# Altium schematic sheet PCB_DYBoard_Bandmaster_V2_SCH1.SchDoc
size A4; SheetNumber: 1; SheetTotal: 4
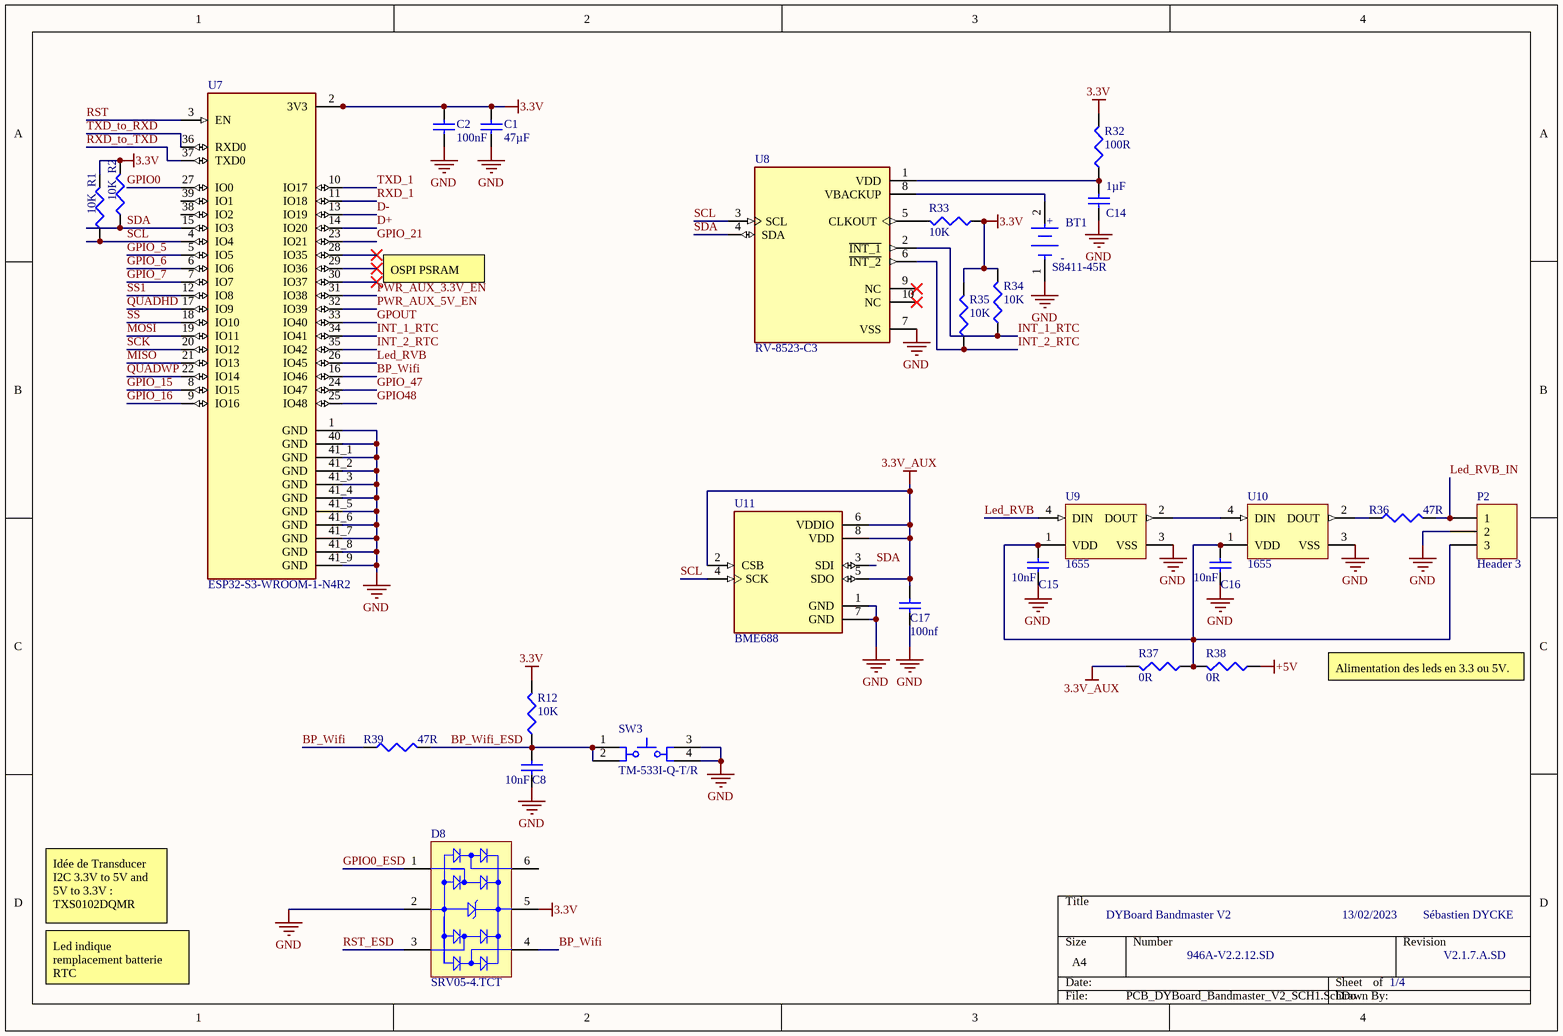
[diagram p0: PCB_DYBoard_Bandmaster_V2_SCH1.SchDoc]

## Parts
BT1  S8411-45R  [FP-S8411-45R-MFG]
C1  value 47µF  [1608[0603]]  (hidden comment: Cap Semi)
C2  value 100nF  [1608[0603]]  (hidden comment: Cap Semi)
C8  value 10nF  [1608[0603]]  (hidden comment: Cap Semi)
C14  value 1µF  [1608[0603]]  (hidden comment: Cap Semi)
C15  value 10nF  [1608[0603]]  (hidden comment: Cap Semi)
C16  value 10nF  [1608[0603]]  (hidden comment: Cap Semi)
C17  value 100nf  [1608[0603]]  (hidden comment: Cap Semi)
D8  SRV05-4.TCT  [SMTC-SOT23-6_V]
P2  Header 3  [HDR1X3]
R1  value 10K  [J1-0603]  (hidden comment: Res3)
R2  value 10K  [J1-0603]  (hidden comment: Res3)
R12  value 10K  [J1-0603]  (hidden comment: Res3)
R32  value 100R  [J1-0603]  (hidden comment: Res3)
R33  value 10K  [J1-0603]  (hidden comment: Res3)
R34  value 10K  [J1-0603]  (hidden comment: Res3)
R35  value 10K  [J1-0603]  (hidden comment: Res3)
R36  value 47R  [J1-0603]  (hidden comment: Res3)
R37  value 0R  [J1-0603]  (hidden comment: Res3)
R38  value 0R  [J1-0603]  (hidden comment: Res3)
R39  value 47R  [J1-0603]  (hidden comment: Res3)
SW3  TM-533I-Q-T/R  [MULT-TM-533I-Q_V]
U7  ESP32-S3-WROOM-1-N4R2  [XCVR_ESP32-S3-WROOM-1-N4R2]
U8  RV-8523-C3  [IC_RV-8523-C3]
U9  1655  [ADA-RGB-1655_V]
U10  1655  [ADA-RGB-1655_V]
U11  BME688  [IC_BME688]

## Nets
3.3V: C1.2 C2.2 D8.5(VBUS) R1.2 R2.2 R12.2 R32.2 R33.1 R34.2 R35.2 U7.2(3V3)
3.3V_AUX: C17.2 R37.2 U11.2(CSB) U11.5(SDO) U11.6(VDDIO) U11.8(VDD)
+5V: R38.1
GND: BT1.1(C) C1.1 C2.1 C8.1 C14.1 C15.1 C16.1 C17.1 D8.2(GND) P2.2 SW3.3 SW3.4 U7.1(GND) U7.40(GND) U7.41_1(GND) U7.41_2(GND) U7.41_3(GND) U7.41_4(GND) U7.41_5(GND) U7.41_6(GND) U7.41_7(GND) U7.41_8(GND) U7.41_9(GND) U8.7(VSS) U9.3(VSS) U10.3(VSS) U11.1(GND) U11.7(GND)
BP_Wifi: D8.4(I/O_3) R39.1 U7.16(IO46)
BP_Wifi_ESD: C8.2 R12.1 R39.2 SW3.1 SW3.2
D+: U7.14(IO20)
D-: U7.13(IO19)
GPIO0: U7.27(IO0)
GPIO0_ESD: D8.1(I/O_1)
GPIO48: U7.25(IO48)
GPIO_5: U7.5(IO5)
GPIO_6: U7.6(IO6)
GPIO_7: U7.7(IO7)
GPIO_15: U7.8(IO15)
GPIO_16: U7.9(IO16)
GPIO_21: U7.23(IO21)
GPIO_47: U7.24(IO47)
GPOUT: U7.33(IO40)
INT_1_RTC: R34.1 U7.34(IO41) U8.2(~{INT_1})
INT_2_RTC: R35.1 U7.35(IO42) U8.6(~{INT_2})
Led_RVB: U7.26(IO45) U9.4(DIN)
Led_RVB_IN: P2.1 R36.2
MISO: U7.21(IO13)
MOSI: U7.19(IO11)
PWR_AUX_3.3V_EN: U7.31(IO38)
PWR_AUX_5V_EN: U7.32(IO39)
QUADHD: U7.17(IO9)
QUADWP: U7.22(IO14)
RST: U7.3(EN)
RST_ESD: D8.3(I/O_2)
RXD_1: U7.11(IO18)
RXD_to_TXD: U7.37(TXD0)
SCK: U7.20(IO12)
SCL: R1.1 U7.4(IO4) U8.3(SCL) U11.4(SCK)
SDA: R2.1 U7.15(IO3) U8.4(SDA) U11.3(SDI)
SS: U7.18(IO10)
SS1: U7.12(IO8)
TXD_1: U7.10(IO17)
TXD_to_RXD: U7.36(RXD0)
NetBT1_2: BT1.2(A) U8.8(VBACKUP)
NetC14_2: C14.2 R32.1 U8.1(VDD)
NetC15_2: C15.2 C16.2 P2.3 R37.1 R38.2 U9.1(VDD) U10.1(VDD)
NetR33_2: R33.2 U8.5(CLKOUT)
NetR36_1: R36.1 U10.2(DOUT)
NetU9_2: U9.2(DOUT) U10.4(DIN)

Not connected (* = marked no-connect by the designer): D8 6(I/O_4); U7 28(IO35)* 29(IO36)* 30(IO37)* 38(IO2) 39(IO1); U8 9(NC)* 10(NC)*

## Notes on the sheet
- OSPI PSRAM
- Alimentation des leds en 3.3 ou 5V.
- Idée de Transducer I2C 3.3V to 5V and 5V to 3.3V : TXS0102DQMR
- DYBoard Bandmaster V2
- 13/02/2023
- Sébastien DYCKE
- Led indique remplacement batterie RTC
- 946A-V2.2.12.SD
- 1/4
- V2.1.7.A.SD
- (in symbol CMP-15817-000007-1) +; -

## Library data of the parts
BT1 = CMP-15817-000007-1: BATTERY HOLDER COIN 12MM SMD; Number of Batteries: 1; Material: Polyphenylene; Case/Package: SMD/SMT; Number of Cells: 1; Min Operating Temperature: -55°C; Termination: SMD/SMT; REACH SVHC: No SVHC; Contact Plating: Bronze; Package Quantity: 500; Max Operating Temperature: 105°C; Mount: Surface Mount; Packaging: Tape and Reel
C1 C2 C8 C14-C17 = Cap Semi: Capacitor (Semiconductor SIM Model); Published: 8-Jun-2000; LatestRevisionDate: 29-May-2009; LatestRevisionNote: IPC-7351 Footprint Added.; PackageReference: C1206; Publisher: Altium Limited; PackageDescription: Chip Capacitor
D8 = CMP-2000-05358-1: RailClamp(R) Low Capacitance TVS Diode Array, 5 pF, 17.5 VC, -55 to 125 degC, 6-Pin SOT23, RoHS, Tape and Reel; Manufacturer: Semtech; Leakage Current (Max): 5uA; Polarity: Uni-Directional; Peak Pulse Power Dissipation: 300W; Clamping Voltage: 17.5V; Number of Elements: 1; Working Voltage: 5V; Test Current (It): 1mA; Configuration: Quad; Reverse Breakdown Voltage: 6V; Suppressor Type: DiodeArrays; Peak Pulse Current: 12A; Product Depth (mm): 1.6mm; Product Height (mm): 1.15mm; Clamping Voltage (Max): 12.5V; Rad Hardened: No; Product Length (mm): 2.9mm; Capacitance Value: 5pF; Mounting: SurfaceMount; Datasheet URL: https://datasheet.ciiva.com/8029/srv05-4-8029973.pdf; Datasheet Version: Jan-08; Packaging: TapeandReel; Package / Case: SOT-23; Operating Temp Range: -55Cto125C; Pin Count: 6; Direction Type: Uni-Directional; Operating Temperature Min Deg. C: -55C; Reverse Stand-off Voltage: 5V; Leakage Current: 5uA; Manufacturer URL: http://www.semtech.com/; Working Voltage (Max): 5V; Package Reference: SOT23-6; Package Description: 6-Pin Small Outline Transistor, Body 2.9 x 1.6 mm, Pitch 0.95 mm; Operating Temperature Max Deg. C: 125C; Operating Temperature Classification: Military; Mounting Style: SurfaceMount
P2 = Header 3: Header, 3-Pin; LatestRevisionDate: 17-Jul-2002; LatestRevisionNote: Re-released for DXP Platform.; Publisher: Altium Limited
R1 R2 R12 R32-R39 = Res3: Resistor; Published: 8-Jun-2000; LatestRevisionDate: 29-May-2009; LatestRevisionNote: IPC-7351 Footprint Added.; PackageReference: J1-0603; Publisher: Altium Limited; PackageDescription: Chip Resistor
SW3 = CMP-1762-00001-1: TACT Switch, SPNO, -25 to 70 degC, 4-Pin SMD, RoHS, Tape and Reel; PackageDescription: 4-Pin Surface Mount Device, Body 5.2 x 5.2 mm; PackageReference: TM-533I-Q-T/R; DatasheetVersion: Rev. 1.1, 12/2011; ComponentLink1Description: Datasheet; ComponentLink1URL: http://www.micropik.com/PDF/pul5x5.pdf
U7 = ESP32-S3-WROOM-1-N4R2: Bluetooth, WiFi 802.11b/g/n, Bluetooth v5.0 Transceiver Module 2.4GHz PCB Trace Surface Mount; MF: Espressif Systems; Package: None; Purchase-URL: https://pricing.snapeda.com/search/part/ESP32-S3-WROOM-1-N4R2/?ref=eda; Price: None; Availability: In Stock; Check_prices: https://www.snapeda.com/parts/ESP32-S3-WROOM-1-N4R2/Espressif+Systems/view-part/?ref=eda; MP: ESP32-S3-WROOM-1-N4R2; SnapEDA_Link: https://www.snapeda.com/parts/ESP32-S3-WROOM-1-N4R2/Espressif+Systems/view-part/?ref=snap; Value: *
U9 U10 = CMP-2000-05026-1: Intelligent Control LED Integrated Light Source, 3.5 to 5.3 V, -25 to 80 degC, 4-Pin SMD, RoHS, Tape and Reel; Manufacturer: Adafruit-Industries-LLC; Number of LEDs: 10; Configuration: Discrete; Utilized LED: WS2812(5050); Datasheet URL: http://datasheet.octopart.com/ADA1655-Adafruit-Industries-datasheet-32028139.pdf; Series: Neopixel; Interface: -; Package Description: 4-Pin Surface Mount Device, Body 5 x 5 mm; Color: Red,Green,Blue(RGB); Category: Optoelectronics; Controller Type: -; Package Reference: 1655; Manufacturer URL: https://www.adafruit.com/; Mounting Type: SurfaceMount; Datasheet Version: May-13; Size / Dimension: 5.00mmLx5.00mmW; Family: Addressable,Specialty
U11 = BME688: Gas sensor measuring relative humidity, barometric pressure, ambient temperature and gas (VOC); Package: None; MP: BME688; Price: None; Availability: Unavailable; Value: *
U8 = RV-8523-C3: Package: None; Value: *; MP: RV-8523-C3; Availability: Unavailable; Price: None